# EAGLE design PoRN (EAGLE 7.1.0)
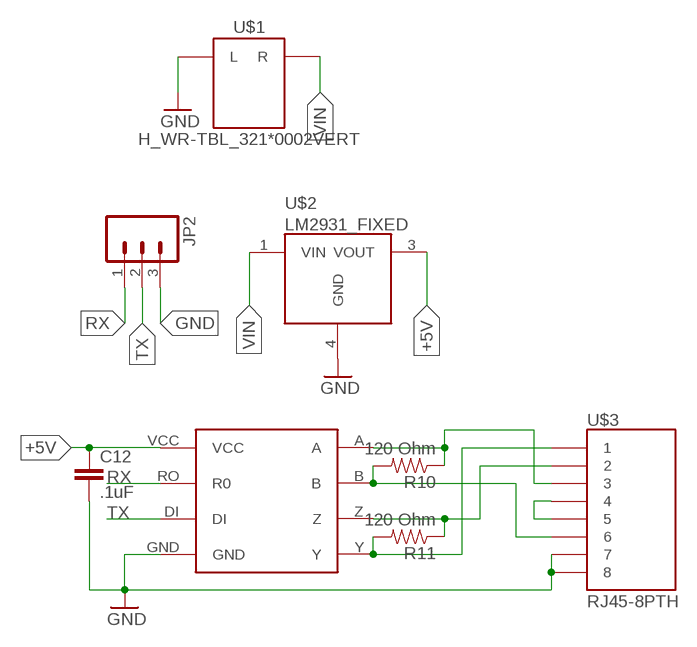
[diagram p0: schematic, sheet 1]

## Parts
C12  .1uF  CAP1206  [1206]
JP2  M03PTH  [1X03]
R10  120 Ohm  RESISTOR1206  [1206]
R11  120 Ohm  RESISTOR1206  [1206]
U$1  H_WR-TBL_321*0002VERT  H_WR-TBL_3210002VERT  [691321100002]
U$2  LM2931_FIXED  [DPAK]
U$3  RJ45-8PTH  [RJ45-8]
U$4  MAX3077  [MAX3070E]

## Nets
+5V: C12.1 U$2.3(VOUT) U$3.4 U$3.5 U$4.VCC
GND: C12.2 JP2.3 U$1.L U$2.4(GND) U$3.7 U$3.8 U$4.GND
N$1: R11.1 U$3.2 U$4.Z
N$2: R10.2 U$3.6 U$4.B
N$3: R10.1 U$3.3 U$4.A
N$5: R11.2 U$3.1 U$4.Y
RX: JP2.1 U$4.RO(R0)
TX: JP2.2 U$4.DI
VIN: U$1.R U$2.1(VIN)

## Library data of the parts
C12 = SparkFun-Capacitors:CAP: Capacitor Standard 0603 ceramic capacitor, and 0.1" leaded capacitor.
JP2 = SparkFun-Connectors:M03: Header 3 Standard 3-pin 0.1" header. Use with straight break away headers (SKU : PRT-00116), right angle break away headers (PRT-00553), swiss pins (PRT-00743), machine pins (PRT-00117), and female headers (PRT-00115). Molex polarized connector foot print use with SKU : PRT-08232 with associated crimp pins and housings.
R10 R11 = SparkFun-Passives:RESISTOR: Resistor Basic schematic elements and footprints for 0603, 1206, and PTH resistors.
U$1 = MRDT-2015-PowerBoard:H_WR-TBL_32*1*0002: Wurth Electronic's 2-pin 10A pluggable screw terminal headers. Vertical and Horizantal Part Numbers: 691322110002 (Horizantal) 691321100002 (Vertical); DIGIKEY_PN: 732-2763-ND
U$2 = SparkFun-PowerIC:LM2931_FIXED: LDO regulator with reverse battery protection- very durable!
U$3 = SparkFun-Connectors:RJ45-8: RJ45 Jack Simple RJ45, 8-pin connection - connector for common Cat5, Cat5e, and Cat6 Ethernet cables. Footprint not yet proven in production. Connector sku is PRT-00643; Breakout PCB sku is BOB-00716.
U$4 = MAX3077:MAX3077

## Board
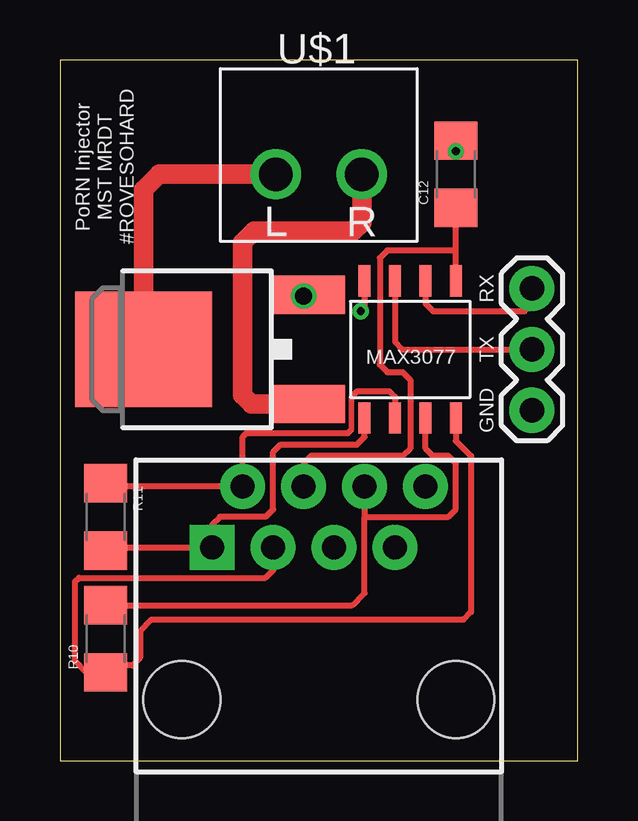
[diagram p1: board, top side]
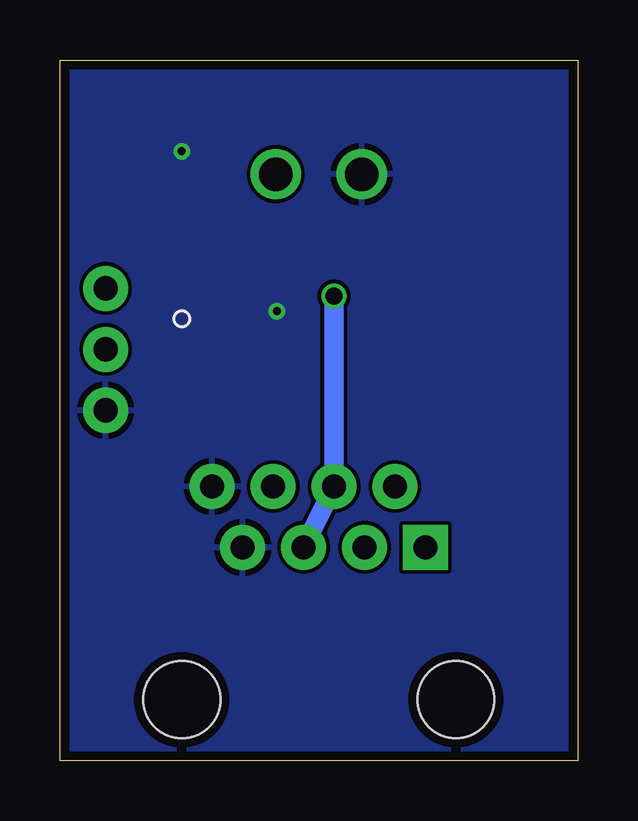
[diagram p2: board, bottom side, seen from below]

Size 21.59 x 29.21 mm. Coordinates in mm from the lower left corner, seen from the top.
Outline: 0,0 21.59,0 21.59,29.21 0,29.21 0,0
Copper layers (1*16): Top 0.0356mm / dielectric 1.5011mm / Bottom 0.0356mm
Design rules "LaenPCBOrder": minimum track width 6mil, minimum drill 13mil, track to track 6mil, track to pad 6mil, pad to pad 6mil, via to via 6mil, smd to smd 6mil, copper to edge 15mil, drill to drill 6mil, minimum pad ring 7mil, minimum via ring 7mil, stop-mask expansion 3mil, vias tented up to drill 0mil, thermal gap 10mil

### Footprints (pad centres in the part's own frame; a part is rotated, then mirrored left to right if it is on the bottom)
1206 = smd 1.6 x 1.8: 1 -1.4,0; 2 1.4,0
1X03 = drill 1.016 pad 1.88: 1 0,0; 2 2.54,0; 3 5.08,0
691321100002 = drill 1.4: L -1.79,0; R 1.79,0
DPAK = smd 1.6 x 3: 1 -2.28,-5.31; 3 2.28,-5.31 | smd 4.826 x 5.715: 4 0,1.588
RJ45-8 = drill 1 pad 1.88 square: 1 -4.445,6.35 | drill 1 pad 1.88: 2 -3.175,8.89; 3 -1.905,6.35; 4 -0.635,8.89; 5 0.635,6.35; 6 1.905,8.89; 7 3.175,6.35; 8 4.445,8.89 | hole 3.2: -5.715,0; 5.715,0
MAX3070E = smd 0.49 x 1.3: A -1.905,2.857; B -0.635,2.857; DI 0.635,-2.857; GND 1.905,-2.857; RO -0.635,-2.857; VCC -1.905,-2.857; Y 1.905,2.857; Z 0.635,2.857

### Placement (x,y rotation side)
C12  16.51,24.45 90 top
JP2  19.68,19.68 270 top
R10  1.91,5.08 90 top
R11  1.91,10.16 270 top
U$1  10.79,24.45 0 top
U$2  5.08,17.14 90 top
U$3  10.79,2.54 0 top
U$4  14.61,17.14 180 top

### Tracks (layer width: path | path; a pad name or v marks a point on that pad's centre or on a via)
+5V  (via drill 0.7)
  Top 0.254: 16.51,20.64 U$4.VCC 16.51,21.27 | 16.51,21.27 13.65,21.27 13.34,20.95 13.34,16.51 13.65,16.19 14.29,16.19 14.61,15.88 14.61,13.02 14.29,12.7 10.48,12.7 10.16,12.38 U$3.4 | 16.51,21.27 16.51,22.54 16.83,22.86 16.7,22.86 C12.1
  Top 0.813: U$2.3 10.1,19.43 v10.16,19.37
  Bottom 0.813: v10.16,19.37 U$3.4 U$3.5
GND  (via drill 0.33)
  Top 0.254: v16.51,25.4 C12.2 | U$4.GND 12.7,18.89 v12.54,18.73
  Top 0.813: U$2.4 3.49,23.81 4.13,24.45 U$1.L
  pour Bottom: 0,-1.27 0,30.48 22.86,30.48 22.86,-1.27
N$1
  Top 0.229: 12.01,13.65 12.16,13.81 12.16,15.16 12.4,15.4
  Top 0.254: R11.1 1.4,11.43 2.09,11.43 U$3.2 7.62,13.49 7.78,13.65 12.01,13.65 | 12.4,15.4 13.73,15.4 13.97,15.16 U$4.Z
  Top 0.406: 1.27,11.43 2.09,11.43 R11.1
N$2
  Top 0.254: R10.2 12.2,6.48 12.7,6.99 12.7,10.16 | U$3.6 12.7,10.16 | 12.7,10.16 16.19,10.16 16.51,10.48 16.51,12.38 16.19,12.7 15.56,12.7 15.24,13.02 U$4.B
N$3
  Top 0.254: U$3.3 8.89,7.94 8.57,7.62 0.79,7.62 0.64,7.46 0.64,4.13 1.08,3.68 R10.1 2.19,3.97 3.02,3.97 3.33,4.29 3.33,5.4 3.81,5.87 16.83,5.87 17.14,6.19 17.14,12.7 16.51,13.34 U$4.A
N$5
  Top 0.254: 1.4,8.89 U$3.1 6.35,9.84 6.67,10.16 8.57,10.16 8.89,10.48 8.89,12.86 9.21,13.18 12.38,13.18 12.7,13.49 U$4.Y
  Top 0.406: 1.4,8.89 R11.2
RX
  Top 0.254: U$4.RO 15.24,19.05 15.56,18.73 19.37,18.73 19.68,19.05 JP2.1
TX
  Top 0.254: U$4.DI 13.97,17.46 14.29,17.14 JP2.2
VIN
  Top 0.813: U$2.1 8,14.87 7.62,15.24 7.62,21.59 8.1,22.07 12.22,22.07 12.59,22.43 U$1.R

### Text on the board
tNames: PoRN Injector / MST MRDT / #ROVESOHARD | RX | TX | GND